# Altium schematic sheet LoraModule.SchDoc
size 420 x 297 mm; Address1: Address1; Address2: Address2; Address3: Address3; Address4: Address4; DocumentNumber: АБВГ.123456.001 Э3; SheetNumber: 1; Scale: 1:1; DocumentType: Схема электрическая принципиальная; FirstReferrence: АБВГ.123456.001
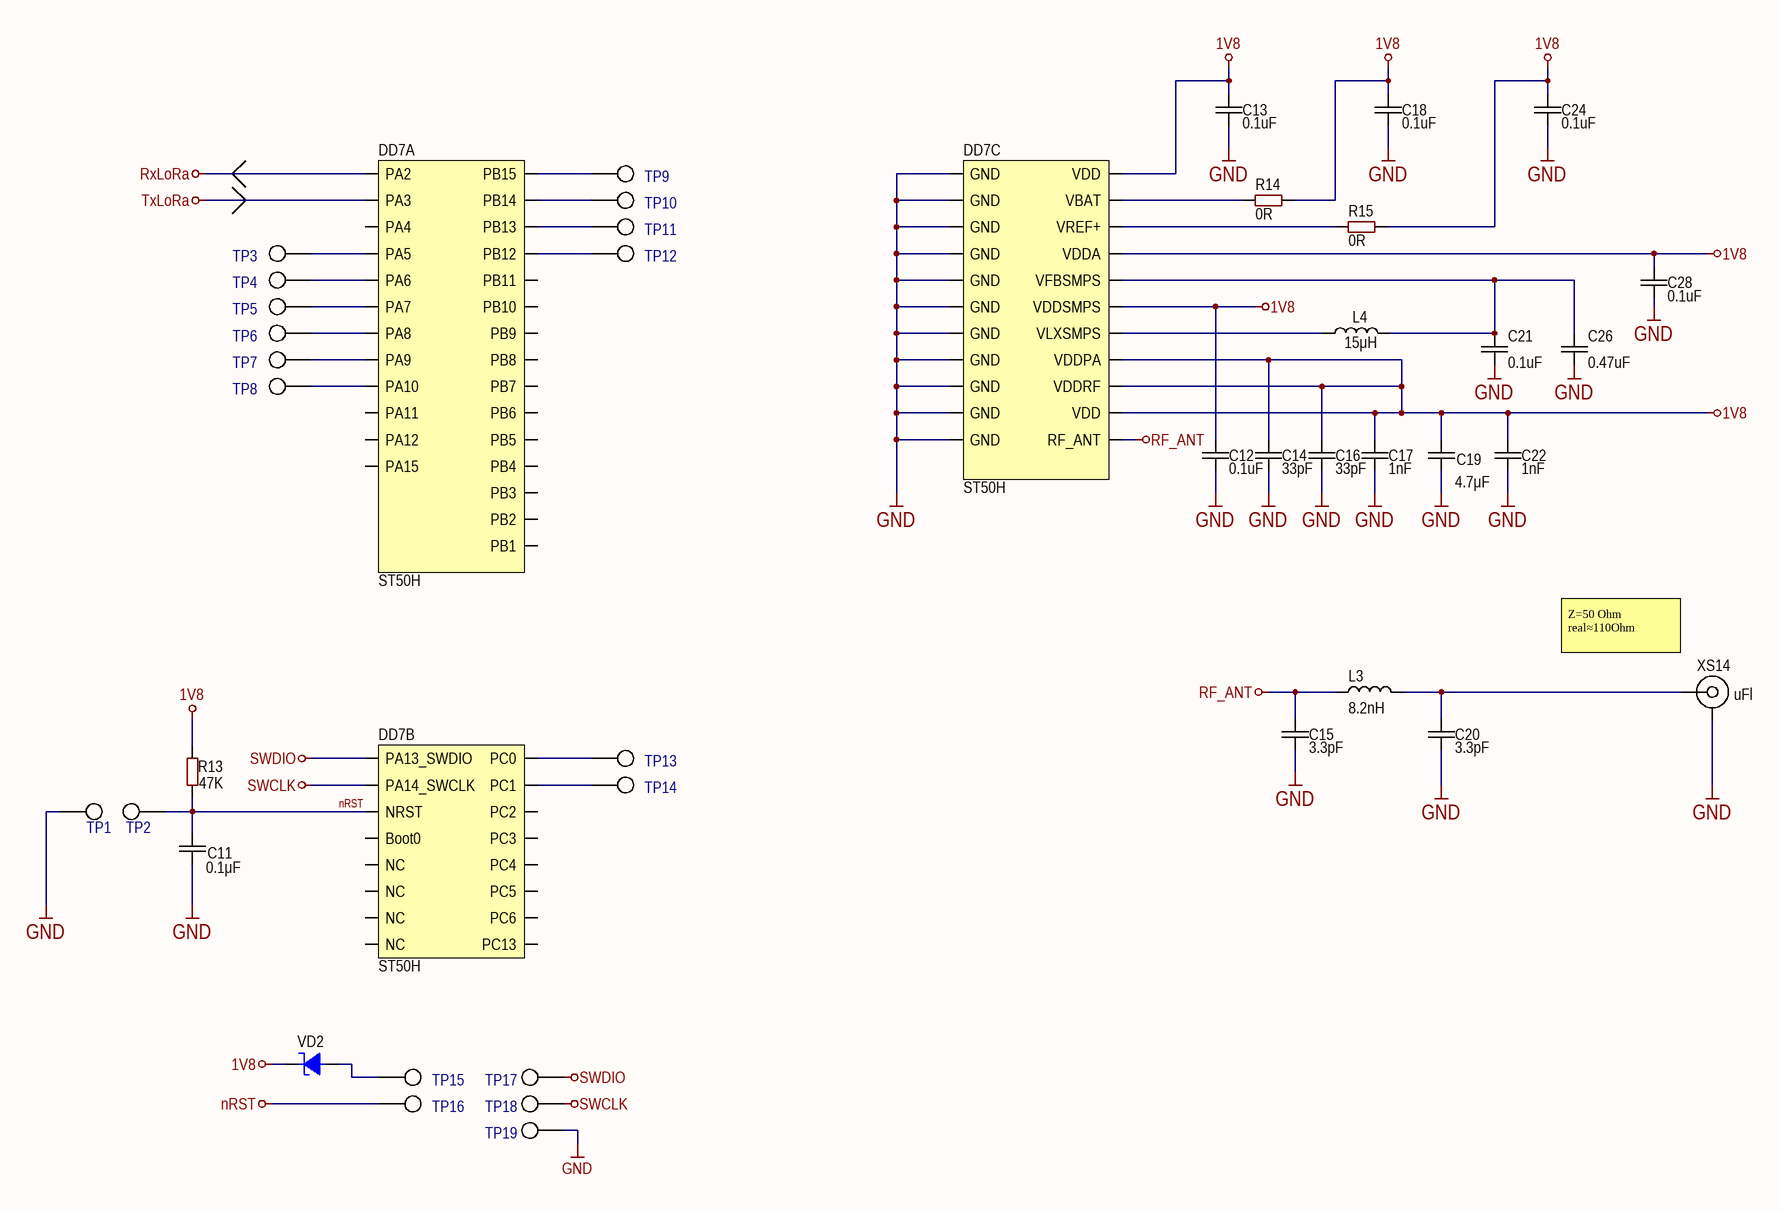
[diagram p0: LoraModule.SchDoc]

## Parts
C11  value 0.1μF  [CAP: 0402]
C12  value 0.1uF  [CAP: 0402]
C13  value 0.1uF  [CAP: 0402]
C14  value 33pF  [CAP: 0402]
C15  value 3.3pF  [CAP: 0402]
C16  value 33pF  [CAP: 0402]
C17  value 1nF  [CAP: 0402]
C18  value 0.1uF  [CAP: 0402]
C19  value 4.7μF  [CAP: 0603]
C20  value 3.3pF  [CAP: 0402]
C21  value 0.1uF  [CAP: 0402]
C22  value 1nF  [CAP: 0402]
C24  value 0.1uF  [CAP: 0402]
C26  value 0.47uF  [CAP: 0402]
C28  value 0.1uF  [CAP: 0402]
DD7  ST50H  [ST50H]  (parts A,B,C of 3)
L3  value 8.2nH  [IND: 0402]
L4  value 15μH  [IND: 0805]
R13  value 47K  [RES: 0402]
R14  value 0R  [RES: 0402]
R15  value 0R  [RES: 0402]
TP1  Testpoint_HS1mm  [TestPoint(without 3D)]  (value not drawn)
TP2  Testpoint_HS1mm  [TestPoint(without 3D)]  (value not drawn)
TP3  Testpoint_HS1mm  [TestPoint(without hole)]  (value not drawn)
TP4  Testpoint_HS1mm  [TestPoint(without hole)]  (value not drawn)
TP5  Testpoint_HS1mm  [TestPoint(without hole)]  (value not drawn)
TP6  Testpoint_HS1mm  [TestPoint(without hole)]  (value not drawn)
TP7  Testpoint_HS1mm  [TestPoint(without hole)]  (value not drawn)
TP8  Testpoint_HS1mm  [TestPoint(without hole)]  (value not drawn)
TP9  Testpoint_HS1mm  [TestPoint(without hole)]  (value not drawn)
TP10  Testpoint_HS1mm  [TestPoint(without hole)]  (value not drawn)
TP11  Testpoint_HS1mm  [TestPoint(without hole)]  (value not drawn)
TP12  Testpoint_HS1mm  [TestPoint(without hole)]  (value not drawn)
TP13  Testpoint_HS1mm  [TestPoint(without hole)]  (value not drawn)
TP14  Testpoint_HS1mm  [TestPoint(without hole)]  (value not drawn)
TP15  Testpoint_HS1mm  [TestPoint(without hole)]  (value not drawn)
TP16  Testpoint_HS1mm  [TestPoint(without hole)]  (value not drawn)
TP17  Testpoint_HS1mm  [TestPoint(without hole)]  (value not drawn)
TP18  Testpoint_HS1mm  [TestPoint(without hole)]  (value not drawn)
TP19  Testpoint_HS1mm  [TestPoint(without hole)]  (value not drawn)
VD2  (no value)  [DIODE: SOD523]
XS14  CommentText: uFl  [CON: u.Fl]

## Nets
1V8: C12.2 C13.2 C14.2 C16.2 C17.2 C18.2 C19.2 C22.2 C24.2 C28.2 DD7.3(VDD) DD7.7(VDDA) DD7.11(VDDSMPS) DD7.53(VDDPA) DD7.54(VDDRF) DD7.55(VDD) R13.2 R14.1 R15.1 VD2.2
GND: C11.1 C12.1 C13.1 C14.1 C15.1 C16.1 C17.1 C18.1 C19.1 C20.1 C21.1 C22.1 C24.1 C26.2 C28.1 DD7.12(GND) DD7.28(GND) DD7.35(GND) DD7.36(GND) DD7.38(GND) DD7.39(GND) DD7.46(GND) DD7.47(GND) DD7.52(GND) DD7.56(GND) DD7.65(GND) TP1.1 TP19.1 XS14.2
nRST: C11.2 DD7.44(NRST) R13.1 TP2.1 TP16.1
RF_ANT: C15.2 DD7.37(RF_ANT) L3.1
RxLoRa: DD7.29(PA2)
SWCLK: DD7.2(PA14_SWCLK) TP18.1
SWDIO: DD7.1(PA13_SWDIO) TP17.1
TxLoRa: DD7.30(PA3)
NetC20_2: C20.2 L3.2 XS14.1
NetC21_2: C21.2 C26.1 DD7.10(VFBSMPS) L4.2
NetDD7_4: DD7.4(VBAT) R14.2
NetDD7_6: DD7.6(VREF+) R15.2
NetDD7_9: DD7.9(PB15) TP9.1
NetDD7_13: DD7.13(VLXSMPS) L4.1
NetDD7_21: DD7.21(PC0) TP13.1
NetDD7_22: DD7.22(PC1) TP14.1
NetDD7_32: DD7.32(PA5) TP3.1
NetDD7_33: DD7.33(PA6) TP4.1
NetDD7_34: DD7.34(PA7) TP5.1
NetDD7_50: DD7.50(PA9) TP7.1
NetDD7_51: DD7.51(PA8) TP6.1
NetDD7_59: DD7.59(PB12) TP12.1
NetDD7_60: DD7.60(PB13) TP11.1
NetDD7_61: DD7.61(PB14) TP10.1
NetDD7_62: DD7.62(PA10) TP8.1
NetTP15_1: TP15.1 VD2.1

Not connected (* = marked no-connect by the designer): DD7 5(PC13) 8(PA15) 14(PB3) 15(PB4) 16(PB5) 17(PB6) 18(PB7) 19(PB8) 20(PB9) 23(PC2) 24(PC3) 25(PC4) 26(PC5) 27(PC6) 31(PA4) 40(NC) 41(NC) 42(NC) 43(Boot0) 45(NC) 48(PB11) 49(PB10) 57(PB1) 58(PB2) 63(PA11) 64(PA12)

## Notes on the sheet
- (near XS14) Z=50 Ohm
  real≈110Ohm
- Перв. примен.
- Справ. №
- Подп. и дата
- Инв. № дубл.
- Взам. инв. №
- Разраб.
- Изм.
- Лист
- № докум.
- Подп.
- Дата
- Лит.
- Масса
- Масштаб
- Пров.
- Т.контр.
- Листов
- Инв. № подл.
- Утв.
- Н.контр.
- 2.106-A3
- Копировал
- Формат А3

## Library data of the parts
C11 = Ceramic_0402: Manufacturer: Yageo; PartNumber: CC0402KRX7R7BB104; ValueManufacturerPartNumber: Ceramic capacitor, 0.1μF, X7R, ±10%, 16V, 0402, -55...+125°C; TypeCapacitor: Ceramic capacitor; Tolerance: ±10%; TypeDielectric: X7R; Voltage: 16V; Package: 0402; HelpURL: https://www.digikey.com/product-detail/en/yageo/CC0402KRX7R7BB104/311-1338-1-ND/2103122; Temperature: -55...+125°C
C12 C13 C18 C21 C24 C28 = Ceramic_0402: Manufacturer: Yageo; PartNumber: CC0402KRX7R7BB104; ValueManufacturerPartNumber: Ceramic capacitor, 0.1uF, X7R, ±10%, 16V, 0402, -55...+125°C; TypeCapacitor: Ceramic capacitor; Tolerance: ±10%; TypeDielectric: X7R; Voltage: 16V; Package: 0402; HelpURL: https://www.digikey.com/product-detail/en/yageo/CC0402KRX7R7BB104/311-1338-1-ND/2103122; Temperature: -55...+125°C
C14 C16 = Ceramic_0402: Manufacturer: Yageo; PartNumber: CC0402KRX7R7BB104; ValueManufacturerPartNumber: Ceramic capacitor, 33pF, X7R, ±10%, 16V, 0402, -55...+125°C; TypeCapacitor: Ceramic capacitor; Tolerance: ±10%; TypeDielectric: X7R; Voltage: 16V; Package: 0402; HelpURL: https://www.digikey.com/product-detail/en/yageo/CC0402KRX7R7BB104/311-1338-1-ND/2103122; Temperature: -55...+125°C
C15 C20 = Ceramic_0402: Manufacturer: Yageo; PartNumber: CC0402KRX7R7BB104; ValueManufacturerPartNumber: Ceramic capacitor, 3.3pF, X7R, ±10%, 16V, 0402, -55...+125°C; TypeCapacitor: Ceramic capacitor; Tolerance: ±10%; TypeDielectric: X7R; Voltage: 16V; Package: 0402; HelpURL: https://www.digikey.com/product-detail/en/yageo/CC0402KRX7R7BB104/311-1338-1-ND/2103122; Temperature: -55...+125°C
C17 C22 = Ceramic_0402: Manufacturer: Yageo; PartNumber: CC0402KRX7R7BB104; ValueManufacturerPartNumber: Ceramic capacitor, 1nF, X7R, ±10%, 16V, 0402, -55...+125°C; TypeCapacitor: Ceramic capacitor; Tolerance: ±10%; TypeDielectric: X7R; Voltage: 16V; Package: 0402; HelpURL: https://www.digikey.com/product-detail/en/yageo/CC0402KRX7R7BB104/311-1338-1-ND/2103122; Temperature: -55...+125°C
C19 = Ceramic_0603: Manufacturer: Yageo; PartNumber: CC0603KRX7R7BB104; ValueManufacturerPartNumber: Ceramic capacitor, 4.7μF, X7R, ±10%, 16V, 0603, -55...+125°C; TypeCapacitor: Ceramic capacitor; Tolerance: ±10%; TypeDielectric: X7R; Voltage: 16V; Package: 0603; HelpURL: https://www.digikey.com/product-detail/en/yageo/CC0603KRX7R7BB104/311-1088-1-ND/302998; Temperature: -55...+125°C
C26 = Ceramic_0402: Manufacturer: Yageo; PartNumber: CC0402KRX7R7BB104; ValueManufacturerPartNumber: Ceramic capacitor, 0.47uF, X7R, ±10%, 16V, 0402, -55...+125°C; TypeCapacitor: Ceramic capacitor; Tolerance: ±10%; TypeDielectric: X7R; Voltage: 16V; Package: 0402; HelpURL: https://www.digikey.com/product-detail/en/yageo/CC0402KRX7R7BB104/311-1338-1-ND/2103122; Temperature: -55...+125°C
DD7 = ST50H: LoRa module
L3 = Inductor_0402: Manufacturer: Murata Electronics; PartNumber: LQG15HSR10J02D; ValueManufacturerPartNumber: Fixed inductor, 8.2nH, ±5%, 0402, 200mA, -55...+125°C; TypeInductor: Fixed inductor; MaxCurrent: 200mA; Tolerance: ±5%; Package: 0402; HelpURL: https://www.digikey.com/product-detail/en/murata-electronics-north-america/LQG15HSR10J02D/490-2635-1-ND/662915; Temperature: -55...+125°C
L4 = Inductor_0805: Manufacturer: Murata Electronics; PartNumber: LQM21FN100M70L; ValueManufacturerPartNumber: Fixed inductor, 15μH, ±20%, 0805, 100mA, -55...+125°C; TypeInductor: Fixed inductor; MaxCurrent: 100mA; Tolerance: ±20%; Package: 0805; HelpURL: https://www.digikey.com/product-detail/en/murata-electronics-north-america/LQM21FN100M70L/490-4029-1-ND/1016289; Temperature: -55...+125°C
R13 = Resistor_0402: Manufacturer: Yageo; PartNumber: RC0402JR-07100RL; ValueManufacturerPartNumber: Resistor film, 47K, ±5%, 0402, 0.063W, -55...+125°C; TypeResistor: Resistor film; Power: 0.063W; Tolerance: ±5%; Package: 0402; HelpURL: https://www.digikey.com/product-detail/en/yageo/RC0402JR-07100RL/311-100JRCT-ND/729362; Temperature: -55...+125°C
R14 R15 = Resistor_0402: Manufacturer: Yageo; PartNumber: RC0402JR-07100RL; ValueManufacturerPartNumber: Resistor film, 0R, ±5%, 0402, 0.063W, -55...+125°C; TypeResistor: Resistor film; Power: 0.063W; Tolerance: ±5%; Package: 0402; HelpURL: https://www.digikey.com/product-detail/en/yageo/RC0402JR-07100RL/311-100JRCT-ND/729362; Temperature: -55...+125°C
VD2 = Schottky_single: Manufacturer: Diodes Incorporated; ValueManufacturerPartNumber: Schottky diode, 80V, 500mA, 1V, 15pF, SOD-123, -55...+150°C; PartNumber: BAT54XV2; TypeDiode: Schottky diode; Voltage: 80V; Current: 500mA; VoltageDrop: 1V; RecoveryTime: 15pF; Package: SOD-123; HelpURL: https://www.digikey.com/product-detail/en/diodes-incorporated/MBR0580S1-7/MBR0580S1-7DICT-ND/5080371; Temperature: -55...+150°C
XS14 = Connector_uFL: Manufacturer: Hirose Electric; ValueManufacturerPartNumber: Connector u.FL, 50 Ohm, 6GHz; PartNumber: U.FL-R-SMT(01); TypeConnector: Connector u.FL; Frequency: 6GHz; Impedance: 50 Ohm; HelpURL: https://www.digikey.com/product-detail/en/hirose-electric-co-ltd/U.FL-R-SMT-01/H9161-ND/513010